# EAGLE design OSSIEPS (EAGLE 6.1)

## Sheet 1 of 3
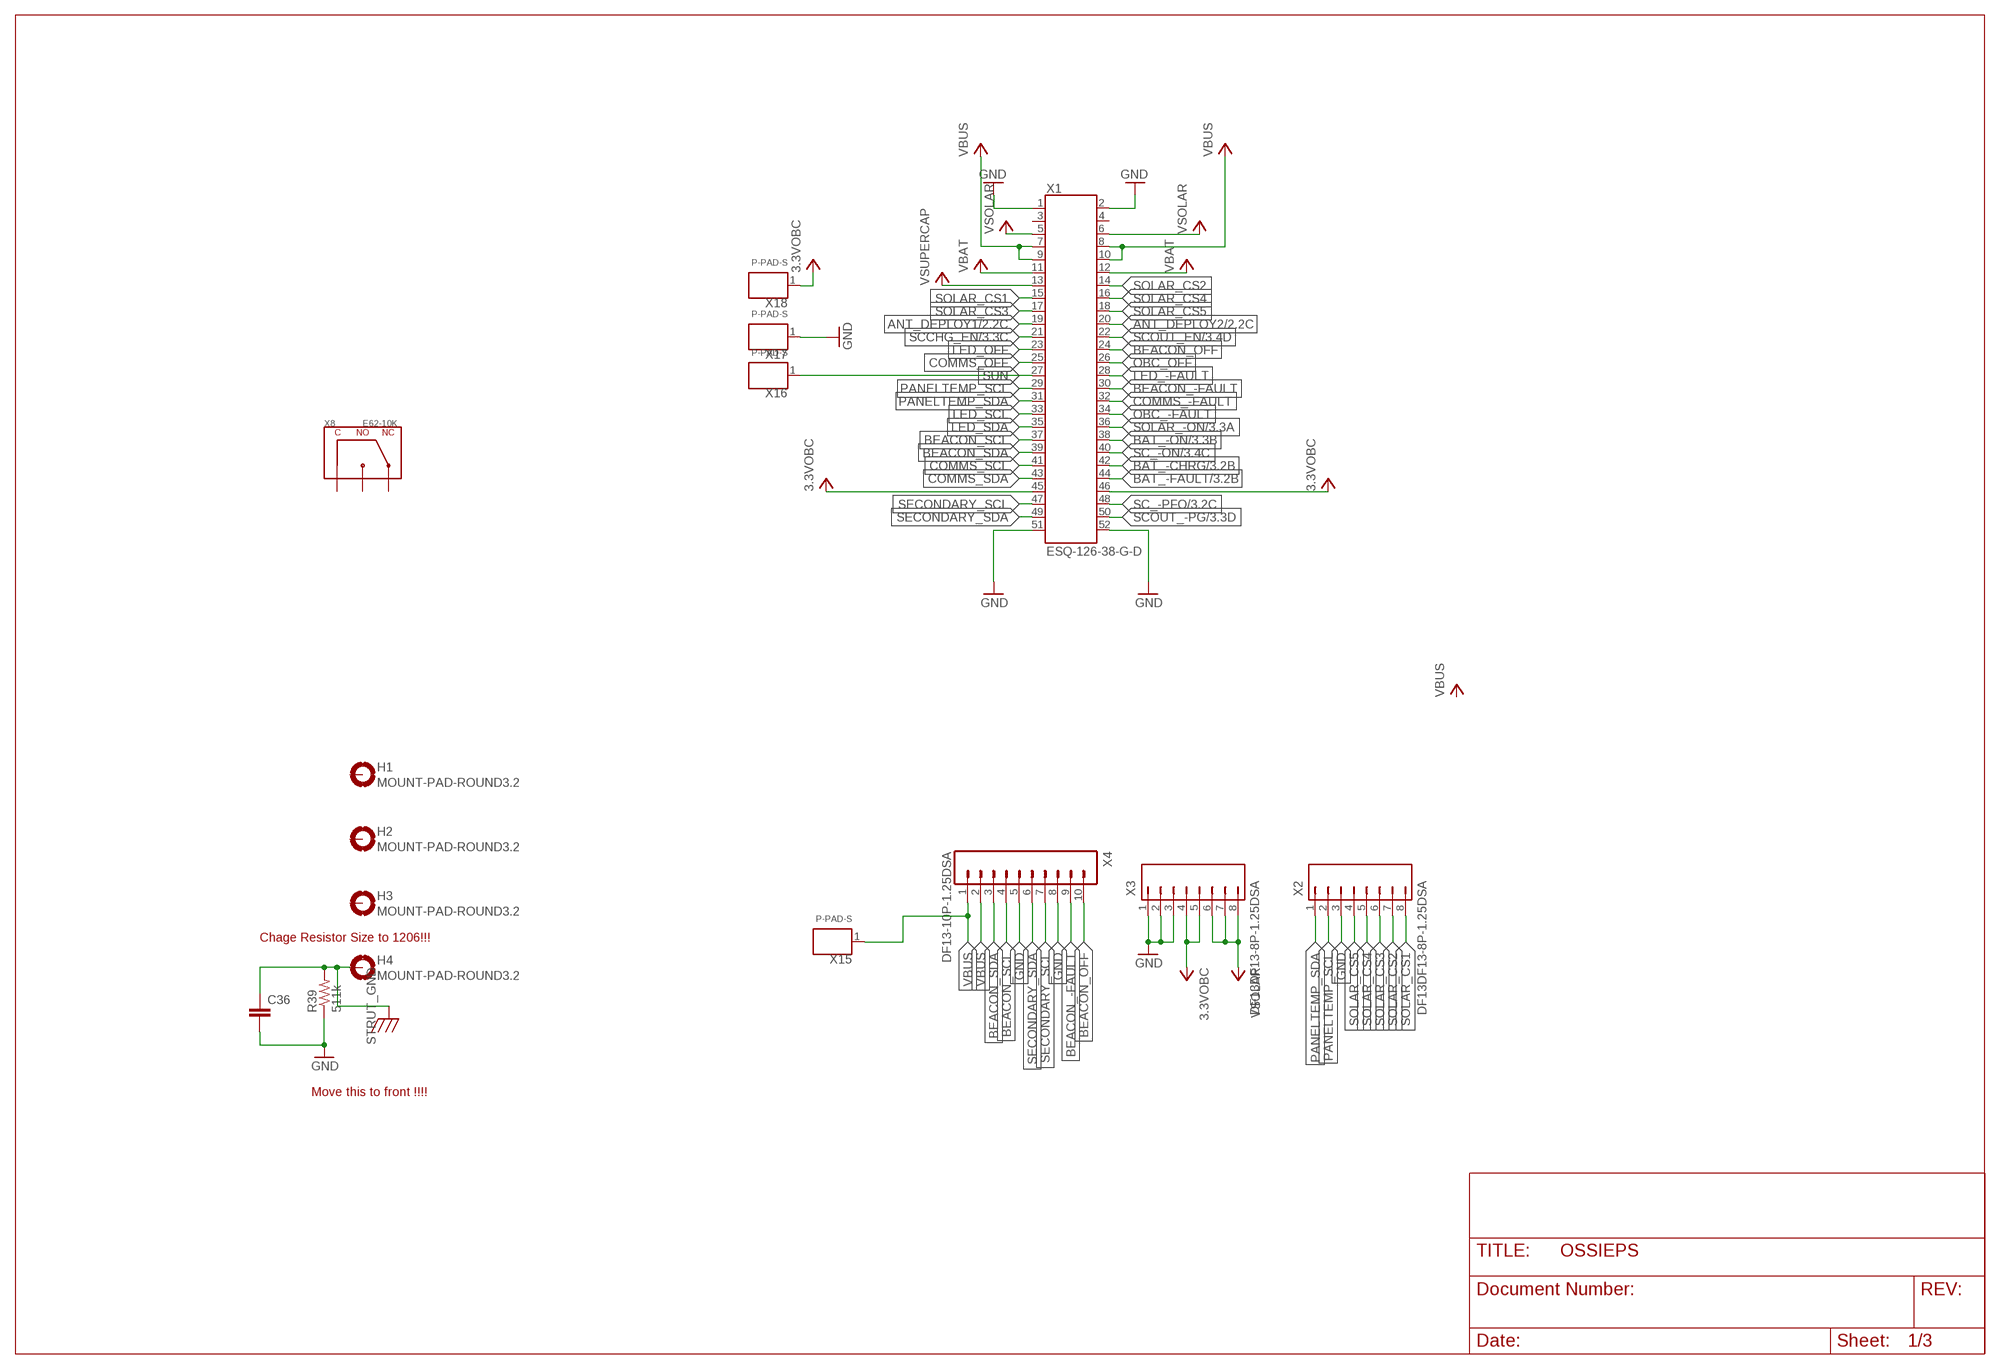
[diagram p0: schematic, sheet 1]

### Parts
C36  C0805(2012)  [C0805(2012)]
H1  MOUNT-PAD-ROUND3.2  [3.2-PAD-ROUND]
H2  MOUNT-PAD-ROUND3.2  [3.2-PAD-ROUND]
H3  MOUNT-PAD-ROUND3.2  [3.2-PAD-ROUND]
H4  MOUNT-PAD-ROUND3.2  [3.2-PAD-ROUND]
R39  511k  R0805(2012)  [R0805(2012)]
X1  ESQ-126-38-G-D  [ESQ-126-XX-X-D]
X2  DF13DF13-8P-1.25DSA  [DF13-8P-1.25DSA]
X3  DF13DF13-8P-1.25DSA  [DF13-8P-1.25DSA]
X4  DF13-10P-1.25DSA  [DF13-10P-1.25DSA]
X8  E62-10K  [E62-10K]
X15  P-PAD-S  [P-PAD-S]
X16  P-PAD-S  [P-PAD-S]
X17  P-PAD-S  [P-PAD-S]
X18  P-PAD-S  [P-PAD-S]

### Nets
3.3VOBC: X1.45 X1.46 X3.4 X3.5 X18.1 ; also sheet 3
ANT_DEPLOY1: X1.19 ; also sheet 2
ANT_DEPLOY2: X1.20 ; also sheet 2
BAT_-CHRG: X1.42 ; also sheet 3
BAT_-FAULT: X1.44 ; also sheet 3
BAT_-ON: X1.38 ; also sheet 3
BEACON_-FAULT: X1.30 X4.9
BEACON_OFF: X1.24 X4.10
BEACON_SCL: X1.37 X4.4
BEACON_SDA: X1.39 X4.3
COMMS_-FAULT: X1.32
COMMS_OFF: X1.25
COMMS_SCL: X1.41
COMMS_SDA: X1.43
GND: C36.2 R39.1 X1.1 X1.2 X1.51 X1.52 X2.3 X3.1 X3.2 X3.3 X4.5 X4.8 X17.1 ; also sheet 2,3
LED_-FAULT: X1.28
LED_OFF: X1.23
LED_SCL: X1.33
LED_SDA: X1.35
OBC_-FAULT: X1.34
OBC_OFF: X1.26
PANELTEMP_SCL: X1.29 X2.2
PANELTEMP_SDA: X1.31 X2.1
SC_-ON: X1.40 ; also sheet 3
SC_-PFO: X1.48 ; also sheet 3
SCCHG_EN: X1.21 ; also sheet 3
SCOUT_-PG: X1.50 ; also sheet 3
SCOUT_EN: X1.22 ; also sheet 3
SECONDARY_SCL: X1.47 X4.7
SECONDARY_SDA: X1.49 X4.6
SOLAR_-ON: X1.36 ; also sheet 3
SOLAR_CS1: X1.15 X2.8
SOLAR_CS2: X1.14 X2.7
SOLAR_CS3: X1.17 X2.6
SOLAR_CS4: X1.16 X2.5
SOLAR_CS5: X1.18 X2.4
STRUT_GND: C36.1 H4.B3,2(MOUNT) R39.2
SUN: X1.27 X16.1
VBAT: X1.11 X1.12 ; also sheet 2,3
VBUS: X1.7 X1.8 X1.9 X1.10 X4.1 X4.2 X15.1 ; also sheet 3
VSOLAR: X1.5 X1.6 X3.6 X3.7 X3.8 ; also sheet 3
VSUPERCAP: X1.13 ; also sheet 3
Unconnected: H1.B3,2(MOUNT) H2.B3,2(MOUNT) H3.B3,2(MOUNT) X1.3 X1.4 X8.C X8.NC X8.NO

### Notes on the sheet
- Chage Resistor Size to 1206!!!
- Move this to front !!!!

## Sheet 2 of 3
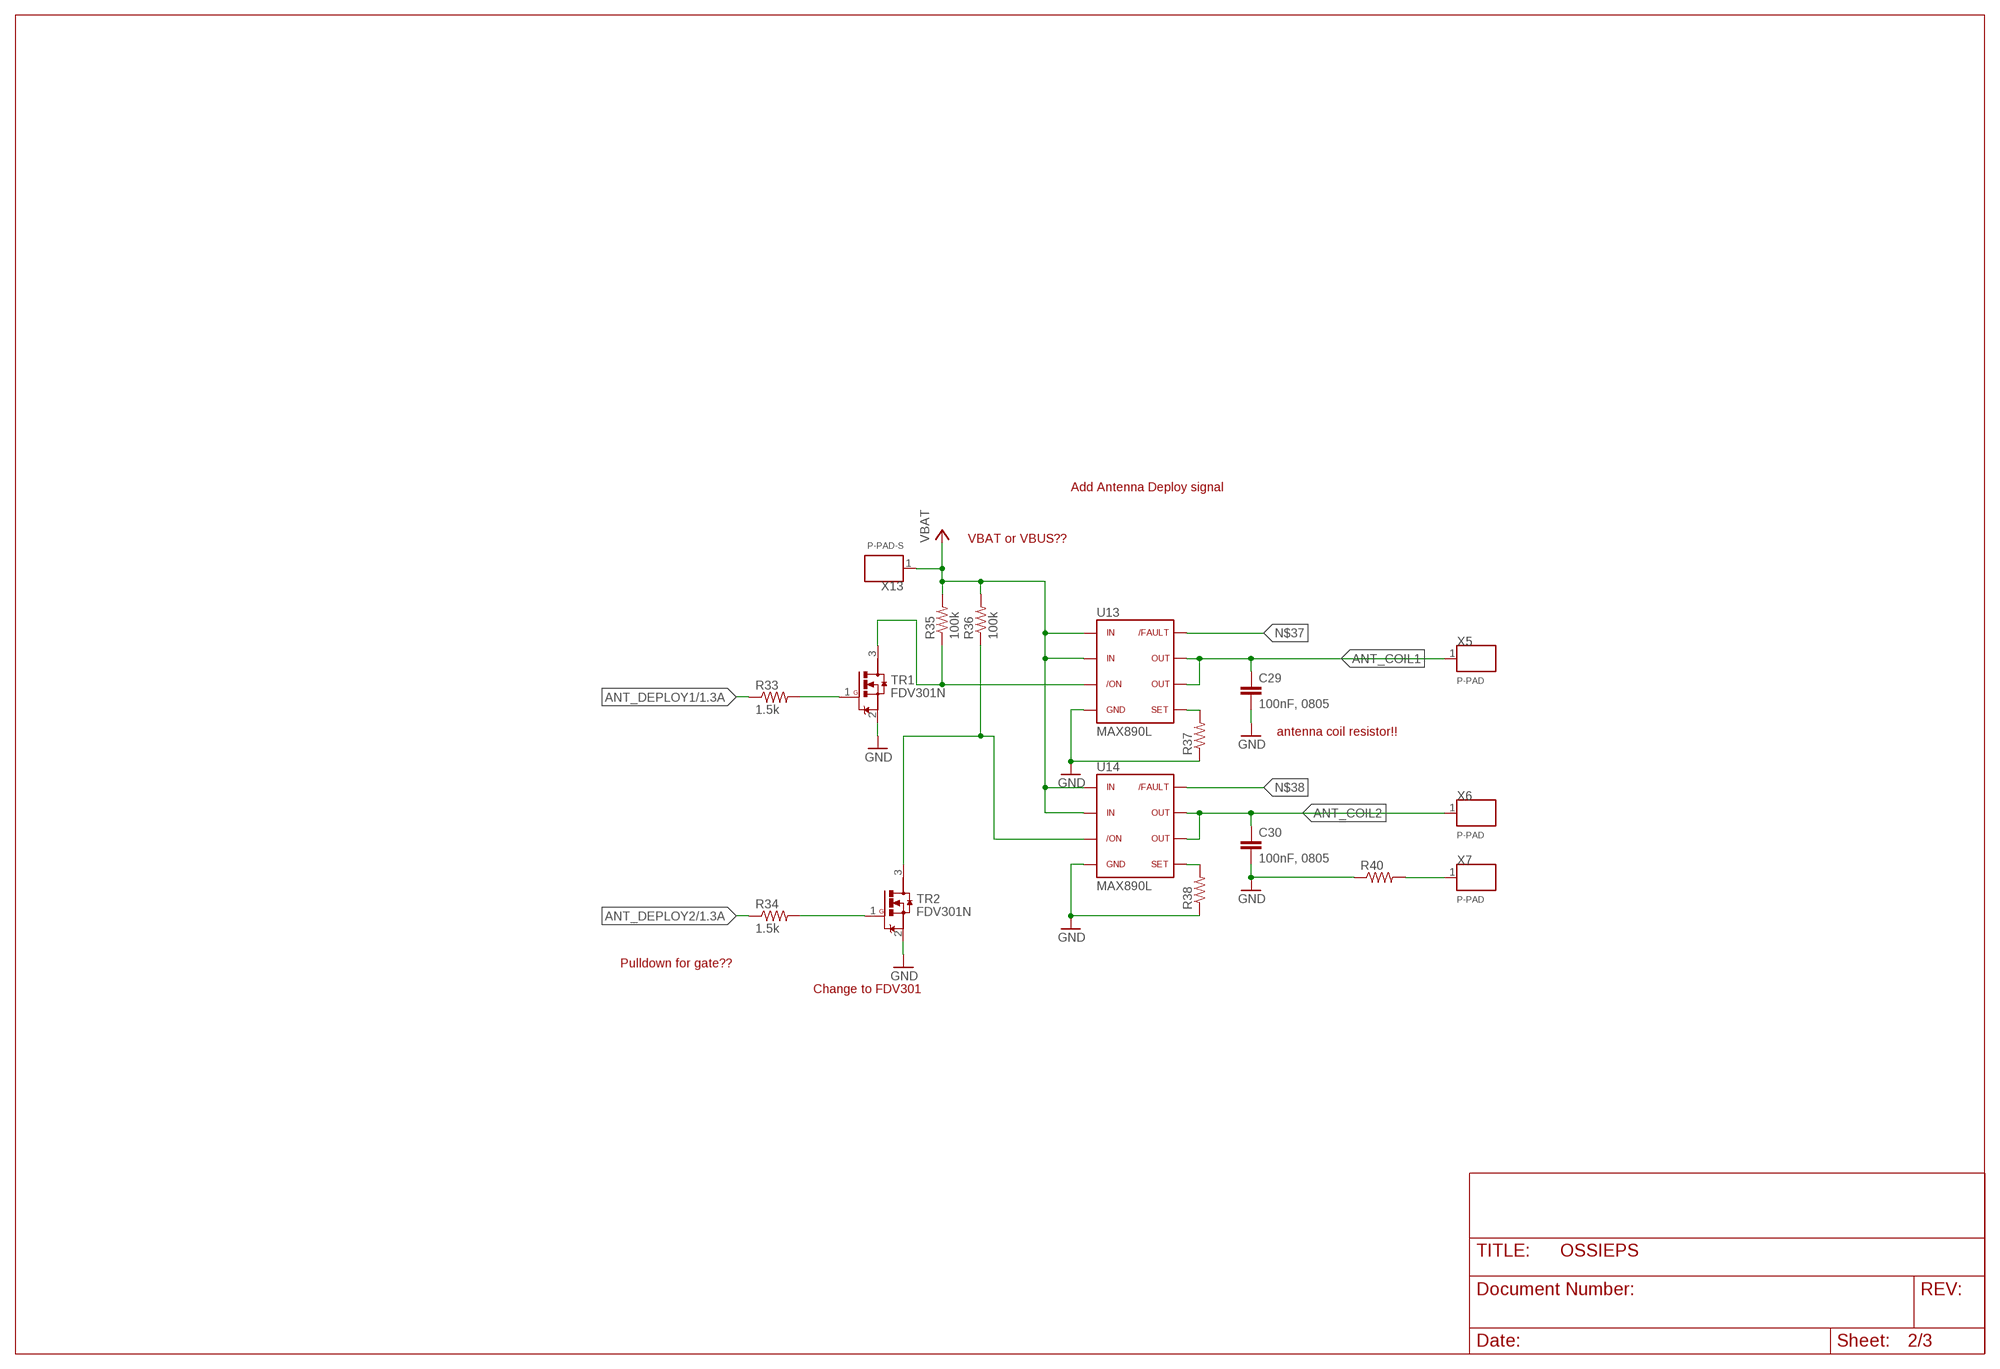
[diagram p1: schematic, sheet 2]

### Parts
C29  100nF, 0805  C0805(2012)  [C0805(2012)]
C30  100nF, 0805  C0805(2012)  [C0805(2012)]
R33  1.5k  R0603(1608)  [R0603(1608)]
R34  1.5k  R0603(1608)  [R0603(1608)]
R35  100k  R0603(1608)  [R0603(1608)]
R36  100k  R0603(1608)  [R0603(1608)]
R37  R0603(1608)  [R0603(1608)]
R38  R0603(1608)  [R0603(1608)]
R40  RPWR263S  [PWR263S-20]
TR1  FDV301N  [SOT23]
TR2  FDV301N  [SOT23]
U13  MAX890L  [SO8]
U14  MAX890L  [SO8]
X5  P-PAD  [P-PAD]
X6  P-PAD  [P-PAD]
X7  P-PAD  [P-PAD]
X13  P-PAD-S  [P-PAD-S]

### Nets
ANT_COIL1: C29.1 U13.6 U13.7 X5.1
ANT_COIL2: C30.1 U14.6 U14.7 X6.1
ANT_DEPLOY1: R33.1 ; also sheet 1
ANT_DEPLOY2: R34.1 ; also sheet 1
GND: C29.2 C30.2 R37.1 R38.1 R40.P$1 TR1.2(S) TR2.2(S) U13.4 U14.4 ; also sheet 1,3
N$33: R34.2 TR2.1(G)
N$37: U13.8
N$38: U14.8
N$49: R33.2 TR1.1(G)
N$50: R35.1 TR1.3(D) U13.3
N$51: R36.1 TR2.3(D) U14.3
N$52: R37.2 U13.5
N$53: R38.2 U14.5
N$57: R40.P$2 X7.1
VBAT: R35.2 R36.2 U13.1 U13.2 U14.1 U14.2 X13.1 ; also sheet 1,3

### Notes on the sheet
- Add Antenna Deploy signal
- VBAT or VBUS??
- antenna coil resistor!!
- Pulldown for gate??
- Change to FDV301

## Sheet 3 of 3
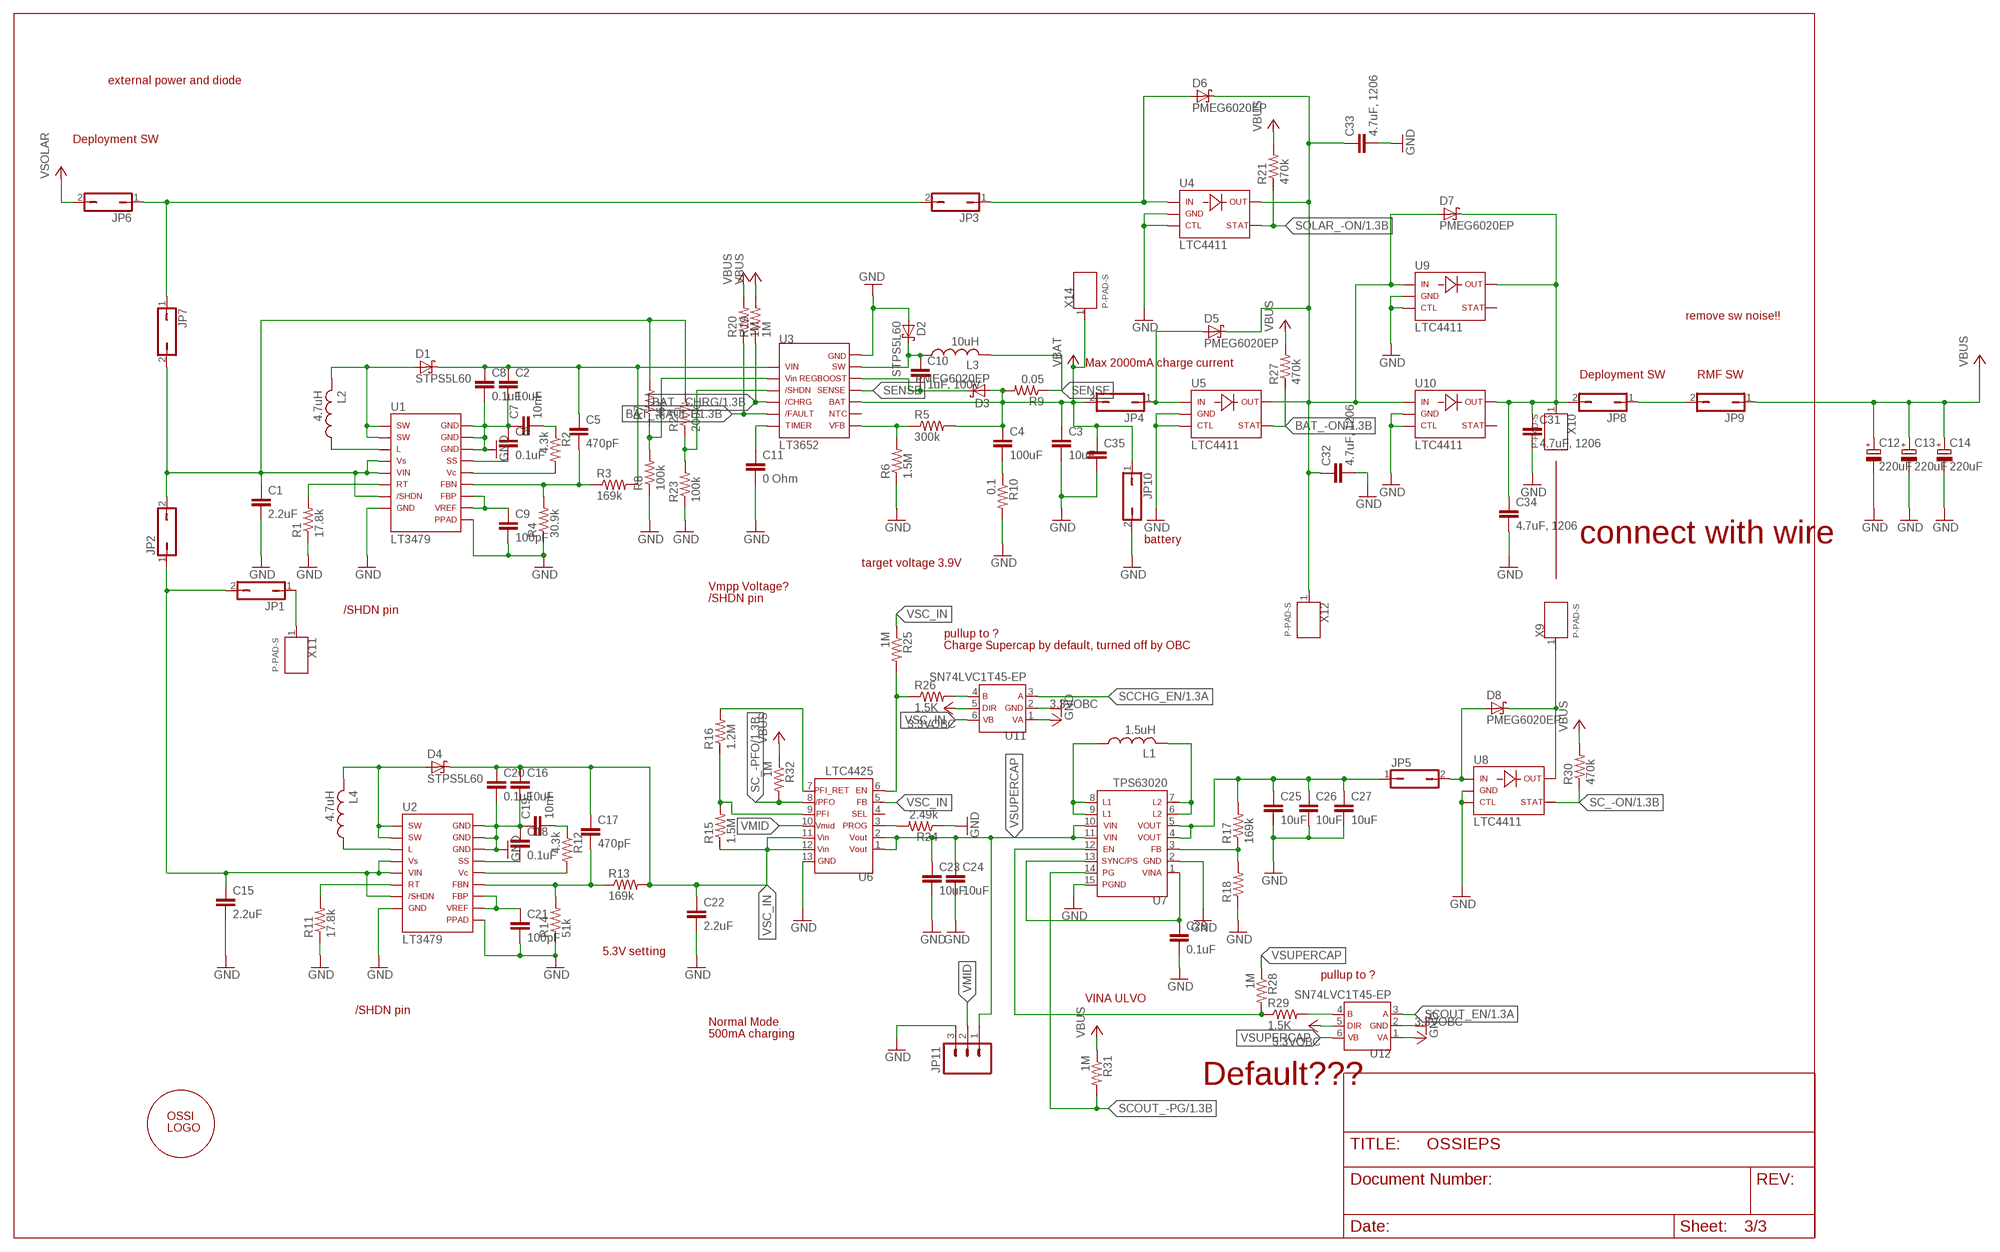
[diagram p2: schematic, sheet 3]

### Parts
C1  2.2uF  C1206(3216)-GCM31  [C1206-GCM31]
C2  10uF  C1210(3225)-GCM32  [C1210-GCM32]
C3  10uF  C1210(3225)-GCM32  [C1210-GCM32]
C4  100uF  C1210(3225)-TMK325  [C1210-TMK325]
C5  470pF  C0603(1608)  [C0603(1608)]
C6  0.1uF  C0603(1608)  [C0603(1608)]
C7  10nF  C0603(1608)  [C0603(1608)]
C8  0.1uF  C0603(1608)  [C0603(1608)]
C9  100pF  C0603(1608)  [C0603(1608)]
C10  1uF, 100V  C0805(2012)  [C0805(2012)]
C11  0 Ohm  C0603(1608)  [C0603(1608)]
C12  220uF  C-TANTAL-Y  [C2917(7343)-Y]
C13  220uF  C-TANTAL-Y  [C2917(7343)-Y]
C14  220uF  C-TANTAL-Y  [C2917(7343)-Y]
C15  2.2uF  C1206(3216)-GCM31  [C1206-GCM31]
C16  10uF  C1210(3225)-GCM32  [C1210-GCM32]
C17  470pF  C0603(1608)  [C0603(1608)]
C18  0.1uF  C0603(1608)  [C0603(1608)]
C19  10nF  C0603(1608)  [C0603(1608)]
C20  0.1uF  C0603(1608)  [C0603(1608)]
C21  100pF  C0603(1608)  [C0603(1608)]
C22  2.2uF  C1206(3216)-GCM31  [C1206-GCM31]
C23  10uF  C1210(3225)-GCM32  [C1210-GCM32]
C24  10uF  C1210(3225)-GCM32  [C1210-GCM32]
C25  10uF  C1210(3225)-GCM32  [C1210-GCM32]
C26  10uF  C1210(3225)-GCM32  [C1210-GCM32]
C27  10uF  C1210(3225)-GCM32  [C1210-GCM32]
C28  0.1uF  C0603(1608)  [C0603(1608)]
C31  4.7uF, 1206  C1206(3216)-GCM31  [C1206-GCM31]
C32  4.7uF, 1206  C1206(3216)-GCM31  [C1206-GCM31]
C33  4.7uF, 1206  C1206(3216)-GCM31  [C1206-GCM31]
C34  4.7uF, 1206  C1206(3216)-GCM31  [C1206-GCM31]
C35  C0603(1608)  [C0603(1608)]
D1  STPS5L60  [STPS5L60]
D2  STPS5L60  [STPS5L60]
D3  PMEG6020EP  [PMEG6020EP]
D4  STPS5L60  [STPS5L60]
D5  PMEG6020EP  [PMEG6020EP]
D6  PMEG6020EP  [PMEG6020EP]
D7  PMEG6020EP  [PMEG6020EP]
D8  PMEG6020EP  [PMEG6020EP]
JP1  JP1Q  [JP1]
JP2  JP1Q  [JP1]
JP3  JP1Q  [JP1]
JP4  JP1Q  [JP1]
JP5  JP1Q  [JP1]
JP6  JP1Q  [JP1]
JP7  JP1Q  [JP1]
JP8  JP1Q  [JP1]
JP9  JP1Q  [JP1]
JP10  JP1Q  [JP1]
JP11  M03POLAR  [MOLEX-1X3]
L1  1.5uH  LXFL4020  [L(4040)]
L2  4.7uH  LRLF7030  [RLF7030]
L3  10uH  LRLF12545  [RLF12545]
L4  4.7uH  LRLF7030  [RLF7030]
R1  17.8k  R0603(1608)  [R0603(1608)]
R2  4.3k  R0603(1608)  [R0603(1608)]
R3  169k  R0603(1608)  [R0603(1608)]
R4  30.9k  R0603(1608)  [R0603(1608)]
R5  300k  R0603(1608)  [R0603(1608)]
R6  1.5M  R0603(1608)  [R0603(1608)]
R7  36k  R0603(1608)  [R0603(1608)]
R8  100k  R0603(1608)  [R0603(1608)]
R9  0.05  RWSL1206  [WSL1206]
R10  0.1  RWSL1206  [WSL1206]
R11  17.8k  R0603(1608)  [R0603(1608)]
R12  4.3k  R0603(1608)  [R0603(1608)]
R13  169k  R0603(1608)  [R0603(1608)]
R14  51k  R0603(1608)  [R0603(1608)]
R15  1.5M  R0603(1608)  [R0603(1608)]
R16  1.2M  R0603(1608)  [R0603(1608)]
R17  169k  R0603(1608)  [R0603(1608)]
R18  R0603(1608)  [R0603(1608)]
R19  1M  R0603(1608)  [R0603(1608)]
R20  1M  R0603(1608)  [R0603(1608)]
R21  470k  R0603(1608)  [R0603(1608)]
R22  200k  R0603(1608)  [R0603(1608)]
R23  100k  R0603(1608)  [R0603(1608)]
R24  2.49k  R0603(1608)  [R0603(1608)]
R25  1M  R0603(1608)  [R0603(1608)]
R26  1.5K  R0603(1608)  [R0603(1608)]
R27  470k  R0603(1608)  [R0603(1608)]
R28  1M  R0603(1608)  [R0603(1608)]
R29  1.5K  R0603(1608)  [R0603(1608)]
R30  470k  R0603(1608)  [R0603(1608)]
R31  1M  R0603(1608)  [R0603(1608)]
R32  1M  R0603(1608)  [R0603(1608)]
U1  LT3479  [TSSOP16-FE]
U2  LT3479  [TSSOP16-FE]
U3  LT3652  [MSE]
U4  LTC4411  [TSOT23-5]
U5  LTC4411  [TSOT23-5]
U6  LTC4425  [MSE]
U7  TPS63020  [VSON-14]
U8  LTC4411  [TSOT23-5]
U9  LTC4411  [TSOT23-5]
U10  LTC4411  [TSOT23-5]
U11  SN74LVC1T45-EP  [SOT-6DCK]
U12  SN74LVC1T45-EP  [SOT-6DCK]
U$1  OSSILOGORECT  [OSSILOGORECT1005]
X9  P-PAD-S  [P-PAD-S]
X10  P-PAD-S  [P-PAD-S]
X11  P-PAD-S  [P-PAD-S]
X12  P-PAD-S  [P-PAD-S]
X14  P-PAD-S  [P-PAD-S]

### Nets
3.3VOBC: U11.1 U11.5 U12.1 U12.5 ; also sheet 1
BAT_-CHRG: R19.1 U3.4 ; also sheet 1
BAT_-FAULT: R20.1 U3.5 ; also sheet 1
BAT_-ON: R27.1 U5.P$4 ; also sheet 1
GND: C1.P$2 C2.P$2 C3.P$2 C6.1 C7.1 C8.2 C9.2 C11.2 C12.2(-) C13.2(-) C14.2(-) C15.P$2 C16.P$2 C18.1 C19.1 C20.2 C21.2 C22.P$2 C23.P$2 C24.P$2 C25.P$2 C26.P$2 C27.P$2 C28.2 C31.P$2 C32.P$2 C33.P$2 C34.P$2 C35.2 D2.A JP10.2 JP11.3 R1.1 R4.1 R6.1 R8.1 R10.P$2 R11.1 R14.1 R18.1 R23.1 R24.1 U1.8 U1.14 U1.15 U1.16 U1.PPAD U2.8 U2.14 U2.15 U2.16 U2.PPAD U3.13 U4.P$2 U4.P$3 U5.P$2 U5.P$3 U6.13 U7.2(GND) U7.15(PGND) U8.P$2 U8.P$3 U9.P$2 U9.P$3 U10.P$2 U10.P$3 U11.2 U12.2 ; also sheet 1,2
N$1: L2.P$1 U1.3
N$2: R7.1 R8.2 U3.2
N$3: C2.P$1 C5.1 C8.1 D1.C R3.2 U3.1
N$4: C4.P$2 R10.P$1
N$5: C6.2 U1.13
N$6: D1.A L2.P$2 U1.1 U1.2
N$7: C7.2 R2.1
N$8: R2.2 U1.12
N$9: C5.2 R3.1 R4.2 U1.11
N$10: C9.1 U1.9 U1.10
N$11: R1.2 U1.6
N$12: R22.1 R23.2 U3.3
N$13: C10.2 D3.C U3.11
N$14: D8.C U8.P$5 X9.1
N$15: L4.P$1 U2.3
N$16: C10.1 D2.C L3.P$1 U3.12
N$17: R5.1 R6.2 U3.7
N$18: C32.P$1 C33.P$1 D5.C D6.C D7.A U4.P$5 U5.P$5 U9.P$1 U10.P$1 X12.1
N$19: C11.1 U3.6
N$20: R26.2 U11.4
N$21: C18.2 U2.13
N$22: D4.A L4.P$2 U2.1 U2.2
N$23: C19.2 R12.1
N$24: R12.2 U2.12
N$25: C17.2 R13.1 R14.2 U2.11
N$26: C21.1 U2.9 U2.10
N$27: R11.2 U2.6
N$28: C15.P$1 JP1.2 JP2.1 U2.4 U2.5 U2.7
N$29: R15.2 R16.1 U6.9
N$30: L1.1 U7.8(L1) U7.9(L1_2)
N$31: R16.2 U6.7
N$32: L1.2 U7.6(L2) U7.7(L2_2)
N$34: C25.P$1 C26.P$1 C27.P$1 JP5.1 R17.2 U7.4(VOUT) U7.5(VOUT2)
N$35: R17.1 R18.2 U7.3(FB)
N$36: C28.1 U7.1(VINA) U7.13(SYNC/PS)
N$39: D6.A JP3.1 U4.P$1
N$40: R24.2 U6.3
N$41: R28.2 R29.1 U7.12(EN)
N$42: D5.A JP4.1 U5.P$1
N$43: D8.A JP5.2 U8.P$1
N$44: C1.P$1 JP2.2 JP7.2 R7.2 R22.2 U1.4 U1.5 U1.7
N$45: R25.2 R26.1 U6.6
N$46: JP3.2 JP6.1 JP7.1
N$47: C31.P$1 C34.P$1 D7.C JP8.2 U9.P$5 U10.P$5 X10.1
N$48: R29.2 U12.4
N$54: JP8.1 JP9.2
N$55: JP1.1 X11.1
SC_-ON: R30.1 U8.P$4 ; also sheet 1
SC_-PFO: R32.2 U6.8 ; also sheet 1
SCCHG_EN: U11.3 ; also sheet 1
SCOUT_-PG: R31.2 U7.14(PG) ; also sheet 1
SCOUT_EN: U12.3 ; also sheet 1
SENSE: L3.P$2 R9.P$1 U3.10
SOLAR_-ON: R21.1 U4.P$4 ; also sheet 1
VBAT: C3.P$1 C4.P$1 C35.1 D3.A JP4.2 JP10.1 R5.2 R9.P$2 U3.9 X14.1 ; also sheet 1,2
VBUS: C12.1(+) C13.1(+) C14.1(+) JP9.1 R19.2 R20.2 R21.2 R27.2 R30.2 R31.1 R32.1 ; also sheet 1
VMID: JP11.2 U6.10
VSC_IN: C16.P$1 C17.1 C20.1 C22.P$1 D4.C R13.2 R15.1 R25.1 U6.5 U6.11 U6.12 U11.6
VSOLAR: JP6.2 ; also sheet 1
VSUPERCAP: C23.P$1 C24.P$1 JP11.1 R28.1 U6.1 U6.2 U7.10(VIN) U7.11(VIN2) U12.6 ; also sheet 1
Unconnected: U3.8 U6.4 U9.P$4 U10.P$4

### Notes on the sheet
- external power and diode
- Deployment SW
- remove sw noise!!
- Max 2000mA charge current
- Deployment SW | RMF SW
- battery | connect with wire
- target voltage 3.9V
- Vmpp Voltage?
- /SHDN pin
- /SHDN pin
- pullup to ?
- Charge Supercap by default, turned off by OBC
- 5.3V setting
- pullup to ?
- VINA ULVO
- /SHDN pin
- Normal Mode
- 500mA charging
- Default???

## Library data of the parts
C1-C11 C15-C36 = OSSI:C
C12-C14 = OSSI:C-TANTAL-Y: TAJY227K010RNJ Taltal Capacitor manufacture: AVX 2917(7343)
D1 D2 D4 = OSSI:STPS5L60: STPS5L60 If: 5A / Vrrm: 60V / Vf: 0.47V @ 5A
D3 D5-D8 = OSSI:PMEG6020EP
H1-H4 = OSSI:MOUNT-PAD-ROUND
JP1-JP10 = OSSI:JP1Q: JUMPER
JP11 = SparkFun:M03: Header 3 Standard 3-pin 0.1" header. Use with straight break away headers (SKU : PRT-00116), right angle break away headers (PRT-00553), swiss pins (PRT-00743), machine pins (PRT-00117), and female headers (PRT-00115). Molex polarized connector foot print use with SKU : PRT-08232 with associated crimp pins and housings.
L1-L4 = OSSI:L
R1-R40 = OSSI:R
TR1 TR2 = OSSI:FDV301N: FDV301N Digital N channel - FET / Rdson = 5 Ohm / Vgs = 0.7~1.06V / Ids = 220mA
U1 U2 = OSSI:LT3479: LT3479 inverting switching convertor Input Voltage Range: 2.5V to 24V 3A, 42V Internal Switch Efﬁciency Power Conversion: Up to 89% Soft-Start Frequency Set by External Resistor: 200kHz to 3.5MHz Protection Against Input Short Circuits and Hot Plugging
U3 = OSSI:LT3652: LT3652 Battery Charger Power Tracking 2A Battery Charger for Solar Power e Input Voltage Range: 4.95V to 32V (40V Abs Max) Programmable Charge Rate Up to 2A Programmable Float Voltage Up to 14.4V 1MHz Fixed Frequency
U4 U5 U8-U10 = OSSI:LTC4411: Linear Techonology LTC4411 ideal diode Small Regulated Forward Voltage (28mV) 2.6A Maximum Forward Current 2.6V to 5.5V Operating Range MOSFET based
U6 = OSSI:LTC4425: LTC4425 Linear SuperCap Charger With Current-Limited Ideal Diode and V/I Monitor
U7 = OSSI:TPS63020: TPS63020 HIGH EFFICIENCY SINGLE INDUCTOR BUCK-BOOST CONVERTER WITH 4-A SWITCHES from Texas Instruments
U11 U12 = OSSI:SN74LVC1T45-EP: SN74LVC1T45-EP SINGLE-BIT DUAL-SUPPLY BUS TRANSCEIVER WITH CONFIGURABLE VOLTAGE TRANSLATION AND 3-STATE OUTPUTS
U13 U14 = OSSI:MAX890L: MAX 890L 1.2A, Current-Limited, High-Side P-Channel Switch with Thermal Shutdown BY MAXIM
U$1 = OSSI:OSSILOGO
X1 = OSSI:ESQ-126-: Samtec ESQ-126-XX-G-D Elevated Sockets Seires ESQ-126-37-G-D ESQ-126-38-G-D ESQ-126-39-G-D
X2 X3 = OSSI:DF13: Hirose DF13 series connector
X4 = OSSI:DF13-10P
X5-X7 X9-X18 = OSSI:P-PAD
X8 = OSSI:E62-10K: Cherry E620-10K spdt sw for Remove Before Flight pin

## Board
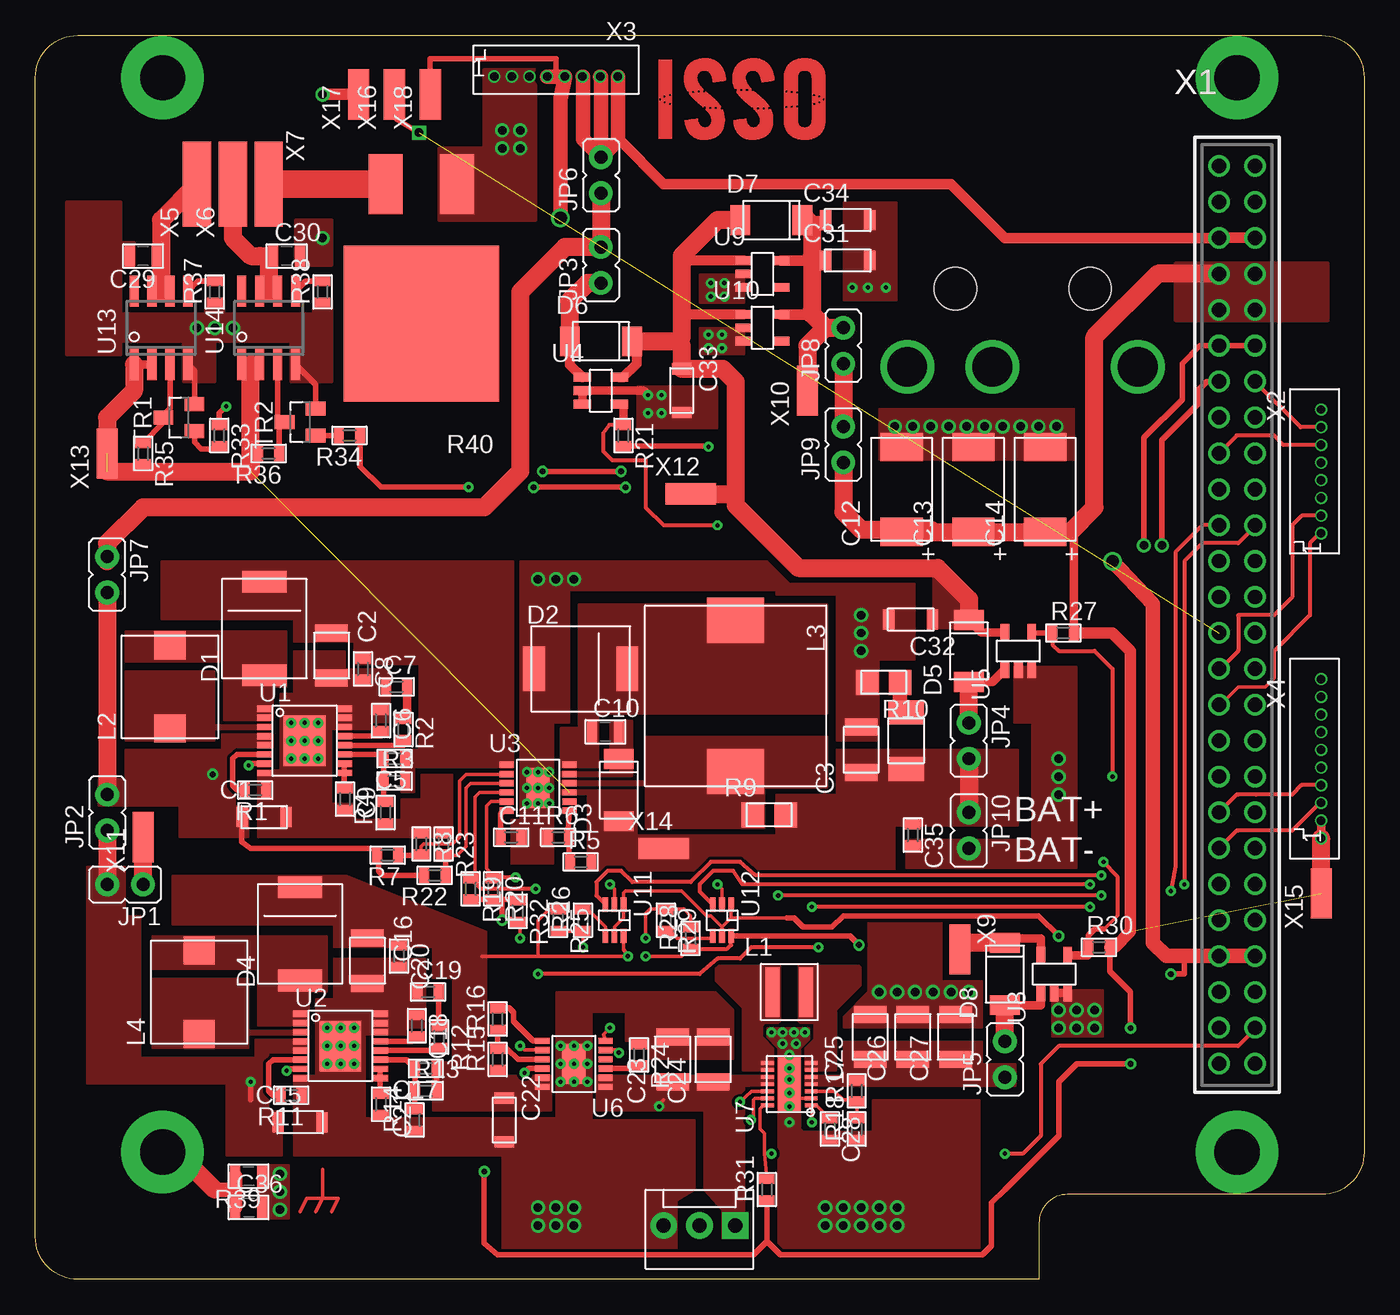
[diagram p3: board, top side]
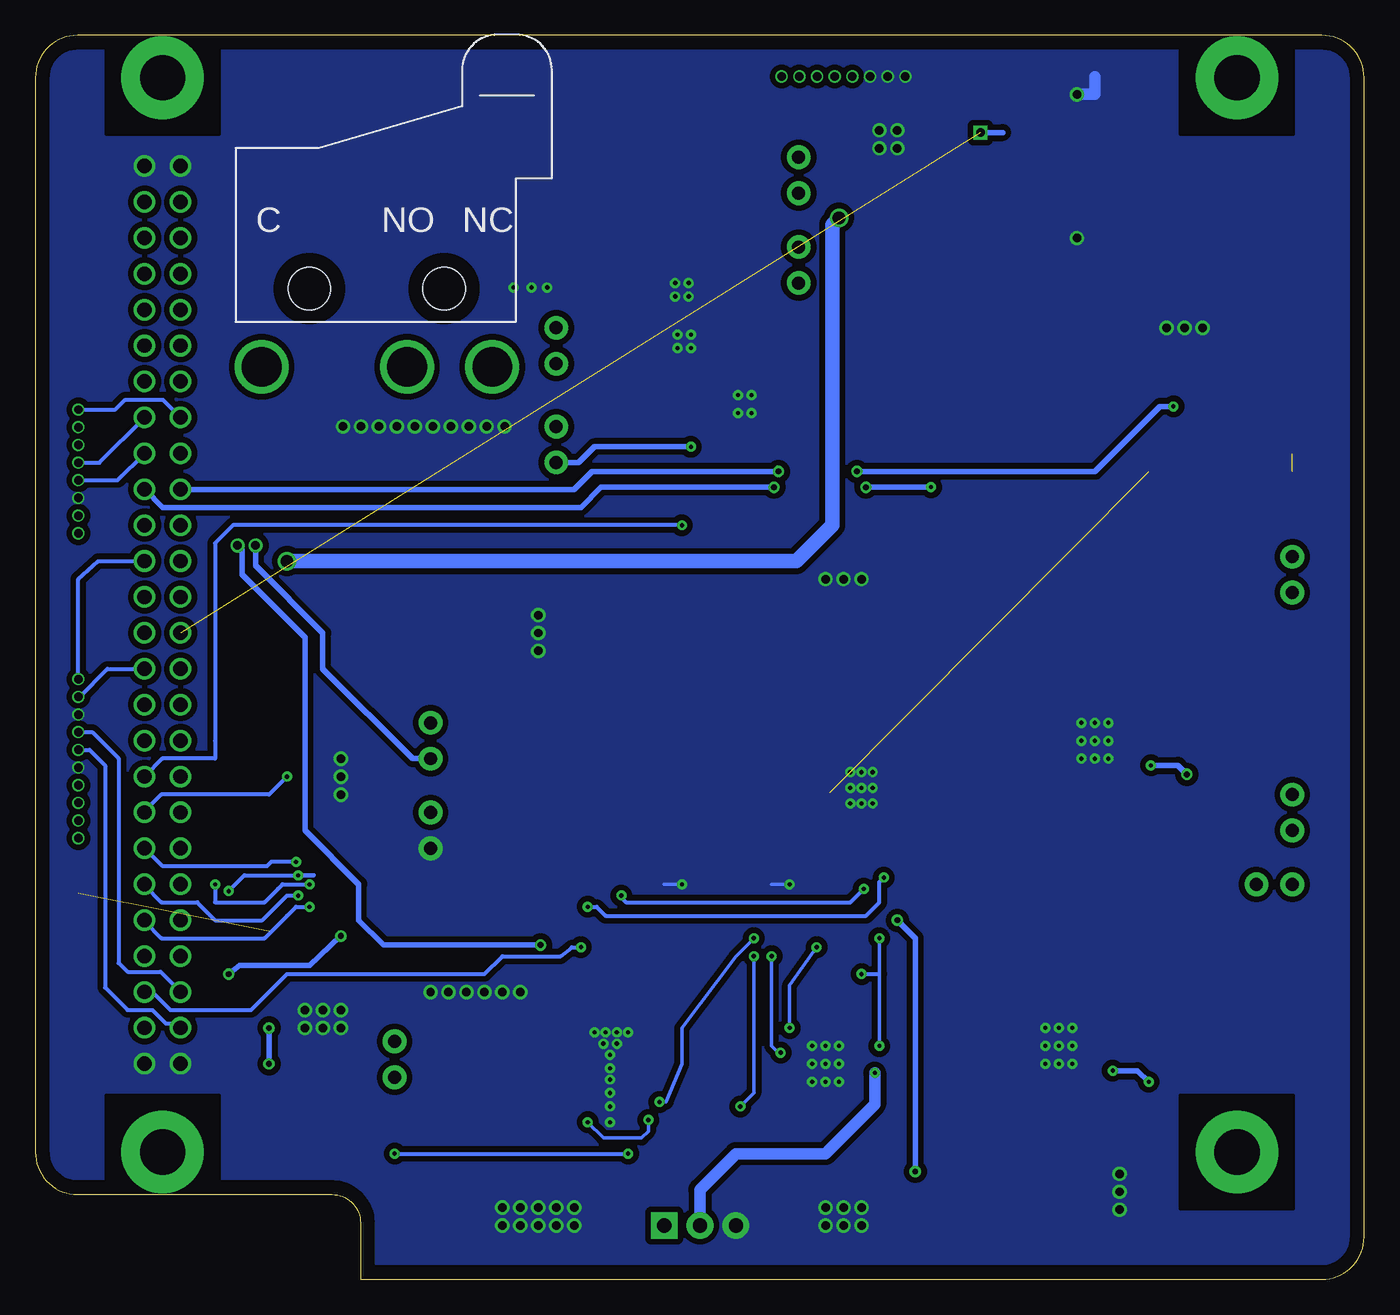
[diagram p4: board, bottom side, seen from below]

Size 94 x 88 mm. Coordinates in mm from the lower left corner, seen from the top.
Outline: 71,0 3,0 arc-90 0,3 0,85 arc-90 3,88 91,88 arc-90 94,85 94,9 arc-90 91,6 73,6 arc90 71,4 71,0
Copper layers (1*16): Top 0.035mm / dielectric 0.8mm / Bottom 0.035mm
Design rules: minimum track width 10mil, minimum drill 10mil, track to track 8mil, track to pad 8mil, pad to pad 8mil, via to via 8mil, smd to smd 8mil, copper to edge 40mil, drill to drill 8mil, minimum pad ring 5mil, minimum via ring 8mil, stop-mask expansion 4mil, vias tented up to drill 0mil, thermal gap 10mil

### Footprints (pad centres in the part's own frame; a part is rotated, then mirrored left to right if it is on the bottom)
C1206-GCM31 = smd 0.8 x 1.4: P$1 -1.55,0; P$2 1.55,0
C1210-GCM32 = smd 1.2 x 2.3: P$1 -1.6,0; P$2 1.6,0
C1210-TMK325 = smd 1.7 x 2.5: P$1 -2,0; P$2 2,0
C0603(1608) = smd 0.7 x 1.1: 1 -0.75,0; 2 0.75,0
C0805(2012) = smd 0.7 x 1.5: 1 -0.95,0; 2 0.95,0
C2917(7343)-Y = smd 2 x 3: 1 -3,0; 2 3,0
STPS5L60 = smd 1.54 x 3.14: A -3.3,0; C 3.3,0
PMEG6020EP = smd 1.4 x 2.1: A -2.2,0; C 2.2,0
3.2-PAD-ROUND = drill 3.2 pad 5.842: B3,2 0,0
JP1 = drill 0.914 pad 1.676: 1 0,-1.27; 2 0,1.27
MOLEX-1X3 = drill 1.016 pad 1.88 square: 1 0,0 | drill 1.016 pad 1.88: 2 2.54,0; 3 5.08,0
L(4040) = smd 1 x 3.5: 1 -1.185,0; 2 1.185,0
RLF7030 = smd 2 x 2.2: P$1 -2.95,0; P$2 2.95,0
RLF12545 = smd 3.2 x 4: P$1 -5.35,0; P$2 5.35,0
R0603(1608) = smd 0.7 x 1.1: 1 -0.75,0; 2 0.75,0
WSL1206 = smd 1.57 x 1.78: P$1 -1.165,0; P$2 1.165,0
R0805(2012) = smd 0.7 x 1.5: 1 -0.95,0; 2 0.95,0
PWR263S-20 = smd 2.4 x 4.23: P$1 -2.54,0; P$2 2.54,0 | smd 11 x 11: TPAD 0,9.865
SOT23 = smd 1 x 1.4: 1 -0.95,-1.1; 2 0.95,-1.1; 3 0,1.1
TSSOP16-FE = smd 0.45 x 1.1: 1 -2.275,-2.8; 2 -1.625,-2.8; 3 -0.975,-2.8; 4 -0.325,-2.8; 5 0.325,-2.8; 6 0.975,-2.8; 7 1.625,-2.8; 8 2.275,-2.8; 9 2.275,2.8; 10 1.625,2.8; 11 0.975,2.8; 12 0.325,2.8; 13 -0.325,2.8; 14 -0.975,2.8; 15 -1.625,2.8; 16 -2.275,2.8 | smd 3.58 x 2.94: PPAD 0,0
MSE = smd 0.45 x 1: 1 -1.625,-2.233; 2 -0.975,-2.233; 3 -0.325,-2.233; 4 0.325,-2.233; 5 0.975,-2.233; 6 1.625,-2.233; 7 1.625,2.233; 8 0.975,2.233; 9 0.325,2.233; 10 -0.325,2.233; 11 -0.975,2.233; 12 -1.625,2.233 | smd 2.845 x 1.65: 13 0,0
TSOT23-5 = smd 0.62 x 1.22: P$1 -0.95,-1.31; P$2 0,-1.31; P$3 0.95,-1.31; P$4 0.95,1.31; P$5 -0.95,1.31
VSON-14 = smd 0.28 x 0.9: 1 -1.5,-1.55; 2 -1,-1.55; 3 -0.5,-1.55; 4 0,-1.55; 5 0.5,-1.55; 6 1,-1.55; 7 1.5,-1.55; 8 1.5,1.55; 9 1,1.55; 10 0.5,1.55; 11 0,1.55; 12 -0.5,1.55; 13 -1,1.55; 14 -1.5,1.55 | smd 4 x 1.58: 15 0,0
SOT-6DCK = smd 0.4 x 1: 1 -0.65,-1.1; 2 0,-1.1; 3 0.65,-1.1; 4 0.65,1.1; 5 0,1.1; 6 -0.65,1.1
SO8 = smd 0.65 x 2.2: 1 -1.905,-2.6; 2 -0.635,-2.6; 3 0.635,-2.6; 4 1.905,-2.6; 5 1.905,2.6; 6 0.635,2.6; 7 -0.635,2.6; 8 -1.905,2.6
ESQ-126-XX-X-D = drill 1.016 pad 1.524: 1 -1.27,31.75; 2 1.27,31.75; 3 -1.27,29.21; 4 1.27,29.21; 5 -1.27,26.67; 6 1.27,26.67; 7 -1.27,24.13; 8 1.27,24.13; 9 -1.27,21.59; 10 1.27,21.59; 11 -1.27,19.05; 12 1.27,19.05; 13 -1.27,16.51; 14 1.27,16.51; 15 -1.27,13.97; 16 1.27,13.97; 17 -1.27,11.43; 18 1.27,11.43; 19 -1.27,8.89; 20 1.27,8.89; 21 -1.27,6.35; 22 1.27,6.35; 23 -1.27,3.81; 24 1.27,3.81; 25 -1.27,1.27; 26 1.27,1.27; 27 -1.27,-1.27; 28 1.27,-1.27; 29 -1.27,-3.81; 30 1.27,-3.81; 31 -1.27,-6.35; 32 1.27,-6.35; 33 -1.27,-8.89; 34 1.27,-8.89; 35 -1.27,-11.43; 36 1.27,-11.43; 37 -1.27,-13.97; 38 1.27,-13.97; 39 -1.27,-16.51; 40 1.27,-16.51; 41 -1.27,-19.05; 42 1.27,-19.05; 43 -1.27,-21.59; 44 1.27,-21.59; 45 -1.27,-24.13; 46 1.27,-24.13; 47 -1.27,-26.67; 48 1.27,-26.67; 49 -1.27,-29.21; 50 1.27,-29.21; 51 -1.27,-31.75; 52 1.27,-31.75
DF13-8P-1.25DSA = drill 0.6: 1 4.375,0; 2 3.125,0; 3 1.875,0; 4 0.625,0; 5 -0.625,0; 6 -1.875,0; 7 -3.125,0; 8 -4.375,0
DF13-10P-1.25DSA = drill 0.6: 1 5.625,0; 2 4.375,0; 3 3.125,0; 4 1.875,0; 5 0.625,0; 6 -0.625,0; 7 -1.875,0; 8 -3.125,0; 9 -4.375,0; 10 -5.625,0
P-PAD = smd 6 x 2: 1 0,0
E62-10K = drill 2.8 pad 3.81: C -17.99,-3.18; NC -1.68,-3.18; NO -7.7,-3.18 | hole 3: -5.08,2.36; -14.61,2.36
P-PAD-S = smd 3.556 x 1.5: 1 0,0

### Placement (x,y rotation side)
C1  16.19,32.7 0 top
C2  20.95,44.13 270 top
C3  58.42,37.47 90 top
C4  61.59,38.1 90 top
C5  25.4,36.83 180 top
C6  24.45,39.53 270 top
C7  25.56,41.91 0 top
C8  23.18,43.18 270 top
C9  21.91,33.97 270 top
C10  40.32,38.73 0 top
C11  33.66,31.27 0 top
C12  61.28,55.88 90 top
C13  66.36,55.88 90 top
C14  71.44,55.88 90 top
C15  18.73,11.11 0 top
C16  23.5,22.54 270 top
C17  27.62,14.92 180 top
C18  26.99,17.94 270 top
C19  27.78,20.32 0 top
C20  25.72,22.86 270 top
C21  24.45,12.38 270 top
C22  33.18,11.27 270 top
C23  45.09,15.56 90 top
C24  47.94,15.56 90 top
C25  59.05,17.14 90 top
C26  62.07,17.14 90 top
C27  65.09,17.14 90 top
C28  56.2,10.64 270 top
C29  7.62,72.39 180 top
C30  17.78,72.39 0 top
C31  57.47,72.07 0 top
C32  61.91,46.67 180 top
C33  45.72,62.87 270 top
C34  57.47,74.93 0 top
C35  62.07,31.43 270 top
C36  15.08,5.08 0 top
D1  16.19,46.04 90 top
D2  38.58,43.18 0 top
D3  41.27,34.61 90 top
D4  18.73,24.45 90 top
D5  66.04,44.45 90 top
D6  40.01,66.36 0 top
D7  52.07,74.93 0 top
D8  68.58,21.59 90 top
H1  9,85 0 top
H2  85,85 0 top
H3  85,9 0 top
H4  9,9 0 top
JP1  6.35,27.94 90 top
JP2  5.08,33.02 0 top
JP3  40.01,71.75 0 top
JP4  66.04,38.1 180 top
JP5  68.58,15.56 0 top
JP6  40.01,78.11 0 top
JP7  5.08,49.85 180 top
JP8  57.15,66.04 0 top
JP9  57.15,59.05 0 top
JP10  66.04,31.75 180 top
JP11  49.52,3.81 180 top
L1  53.34,20.32 0 top
L2  9.53,41.91 90 top
L3  49.53,41.27 270 top
L4  11.59,20.32 90 top
R1  15.56,34.61 180 top
R2  26.04,38.89 270 top
R3  25.4,35.24 0 top
R4  24.77,33.02 90 top
R5  38.58,29.53 0 top
R6  36.99,31.27 0 top
R7  24.92,30 180 top
R8  27.3,30.8 270 top
R9  51.91,32.86 0 top
R10  60.01,42.23 180 top
R11  18.1,13.02 180 top
R12  28.57,17.14 270 top
R13  27.62,13.34 0 top
R14  26.83,11.27 90 top
R15  32.7,15.56 90 top
R16  32.7,18.41 90 top
R17  58.1,13.34 90 top
R18  58.1,10.64 90 top
R19  30.8,27.62 270 top
R20  32.38,27.62 270 top
R21  41.59,59.69 270 top
R22  28.26,28.57 180 top
R23  28.89,30.8 270 top
R24  42.7,15.88 270 top
R25  36.99,25.4 270 top
R26  38.73,25.4 90 top
R27  72.71,45.72 0 top
R28  46.35,24.13 90 top
R29  44.61,25.4 270 top
R30  75.25,23.5 0 top
R31  51.75,6.35 90 top
R32  34.13,26.04 270 top
R33  13.02,59.69 270 top
R34  22.23,59.69 180 top
R35  7.62,58.42 270 top
R36  16.51,58.42 180 top
R37  12.7,69.85 90 top
R38  20.32,69.85 90 top
R39  15.08,7.3 180 top
R40  27.3,77.47 180 top
TR1  10.16,60.96 90 top
TR2  18.73,60.64 90 top
U1  19.05,38.1 270 top
U2  21.59,16.51 270 top
U3  35.56,34.77 270 top
U4  40.01,62.87 270 top
U5  69.53,44.45 0 top
U6  38.1,15.24 90 top
U7  53.34,13.81 90 top
U8  72.07,21.59 0 top
U9  51.44,71.12 270 top
U10  51.44,67.31 270 top
U11  40.96,25.4 180 top
U12  48.58,25.4 180 top
U13  8.89,67.31 0 top
U14  16.51,67.31 0 top
U$1  55.88,86.36 180 top
X1  85,47 0 top
X2  90.96,57.15 270 top
X3  36.83,85.09 180 top
X4  90.96,36.83 270 top
X5  11.43,77.47 90 top
X6  13.97,77.47 90 top
X7  16.51,77.47 270 top
X8  60,67.73 0 bottom
X9  65.41,23.34 270 top
X10  54.61,62.87 90 top
X11  7.62,31.27 90 top
X12  46.35,55.56 0 top
X13  5.08,58.42 90 top
X14  44.45,30.48 0 top
X15  90.96,27.3 90 top
X16  25.4,83.82 90 top
X17  22.86,83.82 90 top
X18  27.94,83.82 90 top

### Tracks (layer width: path | path; a pad name or v marks a point on that pad's centre or on a via)
3.3VOBC  (via drill 0.4, 0.9)
  Top 0.254: U11.5 40.96,24.92 41.59,25.56 41.59,26.51 41.6,26.51 U11.1 41.61,27.32 41.75,27.46 45.72,27.46 47.47,25.72 47.78,25.72 48.58,24.92 | U12.5 48.58,24.92 | 48.58,24.92 49.21,25.56 | 49.21,25.56 49.21,26.48 U12.1 | 49.21,25.56 53.18,25.56
  Top 0.4: 53.18,25.56 53.66,25.56 54.29,24.92 56.36,24.92 57.15,25.72 70.96,25.72 v72.39,24.29 | v80.33,21.59 81.27,21.59 81.28,22.87
  Top 0.406: X18.1 27.94,86.36 36.83,86.36 36.83,85.09 X3.4
  Top 1.016: X1.46 83.83,22.87 83.82,22.86 83.81,22.87 X1.45 81.28,22.87 80,22.87 79.06,23.81 79.06,47.78 v76.2,50.8 | v37.15,75.09 37.15,83.5 37.47,85.09 X3.5 36.83,85.09 X3.4
  Bottom 0.4: v72.39,24.29 74.61,22.23 74.77,22.23 79.53,22.23 v80.33,21.59
  Bottom 1.016: v76.2,50.8 40.16,50.8 37.62,53.34 37.62,74.61 v37.15,75.09
ANT_COIL1
  Top 0.305: U13.7 8.83,69.91 8.89,69.85 8.95,69.91 U13.6 | C29.1 8.57,72.71 8.89,72.39
  Top 1.27: X5.1 8.89,74.93 8.89,72.39 8.89,69.85
ANT_COIL2
  Top 0.254: C30.1 16.51,72.39
  Top 0.305: U14.7 16.45,69.91 16.51,69.85 17.09,69.85 U14.6
  Top 1.27: X6.1 13.97,73.66 15.24,72.39 15.88,72.39 16.51,72.39 16.51,69.85
ANT_DEPLOY1  (via drill 0.3, 0.4)
  Top 0.4: R33.1 13.02,61.28 v13.49,61.75 | v35.88,57.15 v41.43,57.15
  Bottom 0.4: v13.49,61.75 14.45,61.75 19.05,57.15 v35.88,57.15 | v41.43,57.15 54.61,57.15 55.88,55.88 X1.19
ANT_DEPLOY2  (via drill 0.3, 0.4)
  Top 0.4: R34.1 22.98,57.51 24.45,56.04 v30.64,56.04 | v35.24,56.04 v41.75,56.04
  Bottom 0.4: v30.64,56.04 v35.24,56.04 | v41.75,56.04 53.98,56.04 55.4,54.61 84.99,54.61 X1.20
BAT_-CHRG  (via drill 0.3)
  Top 0.254: U3.4 31.43,34.44 31.11,34.13 31.11,28.73 30.8,28.42 R19.1
  Top 0.3: v75.41,27.15 v52.55,27.15 | v35.4,27.62 31.55,27.62 R19.1
  Bottom 0.3: X1.42 86.27,27.85 85.09,26.67 82.55,26.67 81.28,25.4 77.95,25.4 76.52,26.83 76.2,27.15 v75.41,27.15 | v52.55,27.15 52.55,26.99 52.23,26.67 36.35,26.67 v35.4,27.62
BAT_-FAULT  (via drill 0.3)
  Top 0.254: R20.1 32.38,28.57 31.91,29.05 31.91,33.5 32.23,33.81 33.44,33.81 U3.5
  Top 0.3: v74.61,26.35 v54.93,26.35 | v33.97,28.42 32.43,28.42 R20.1
  Bottom 0.3: X1.44 86.27,25.31 85.09,24.13 77.79,24.13 76.2,25.72 75.56,26.35 v74.61,26.35 | v54.93,26.35 54.29,26.35 53.66,25.72 35.24,25.72 34.29,26.67 34.29,28.1 v33.97,28.42
BAT_-ON  (via drill 0.3)
  Top 0.3: R27.1 71.96,44.88 72.39,44.45 74.93,44.45 76.2,43.18 v76.2,35.56
  Top 0.406: R27.1 70.52,45.72 U5.P$4
  Bottom 0.3: v76.2,35.56 77.47,34.29 85.09,34.29 86.36,33.02 86.35,33.03 X1.38
BEACON_-FAULT
  Bottom 0.3: X4.9 90.88,41.2 88.9,43.18 X1.30
BEACON_OFF
  Bottom 0.3: X4.10 90.96,49.53 89.53,50.8 X1.24
BEACON_SCL
  Top 0.3: X4.4 89.56,34.95 88.9,34.29 86.36,34.29 85.09,34.29 84.99,34.29 X1.37
BEACON_SDA
  Top 0.3: X4.3 90.86,33.7 88.9,31.75 85.09,31.75 84.99,31.75 X1.39
GND  (via drill 0.3, 0.6)
  Top 0.254: U7.2 53.45,12.81 53.34,12.7 53.34,13.97 v53.34,14.13 | U12.2 48.58,27.62 v48.26,27.94 | U11.2 40.96,27.62 v40.64,27.94
  Top 0.406: TR1.2 11.26,64.25 U13.4 | TR2.2 19.83,63.29 U14.4
  Top 0.61: U8.P$3 U8.P$2 | 38.73,62.87 38.73,62.71 38.7,62.67 U4.P$3 38.7,62.83 38.73,62.87 | 38.73,62.87 U4.P$2 | 38.73,62.87 43.02,62.87 v43.34,62.55
  Top 0.813: X17.1 v20.32,83.82
  Bottom 0.254: v40.64,27.94 41.91,27.94 | v48.26,27.94 49.53,27.94
  Bottom 0.813: v20.32,83.82 19.05,83.82 19.05,85.09
  other vias: 12.7,67.31 13.97,67.31 11.43,67.31 20.32,73.66 33.02,81.28 34.29,81.28 34.29,80.01 33.02,80.01 19.05,38.1 19.05,36.83 19.05,39.37 35.56,34.77 35.56,35.88 35.56,33.66 21.59,16.51 21.59,17.78 21.59,15.24 38.1,15.24 38.1,16.51 38.1,13.97 20.64,17.78 20.64,16.51 20.64,15.24 22.54,15.24 22.54,16.51 22.54,17.78 20,39.37 20,38.1 20,36.83 18.1,36.83 18.1,38.1 18.1,39.37 37.15,13.97 37.15,15.24 37.15,16.51 39.05,16.51 39.05,15.24 39.05,13.97 53.34,14.92 53.34,15.88 53.34,13.18 52.07,17.46 52.86,17.46 53.66,17.46 54.45,17.46 52.86,16.67 53.82,16.67 53.34,12.22 53.34,11.11 55.88,5.08 58.42,5.08 60.96,5.08 57.15,5.08 59.69,5.08 55.88,3.81 57.15,3.81 58.42,3.81 59.69,3.81 60.96,3.81 17.3,4.92 17.3,6.19 17.3,7.46 34.77,35.88 36.35,35.88 34.77,34.77 36.35,34.77 34.77,33.66 36.35,33.66 60.8,60.33 62.07,60.33 63.34,60.33 64.61,60.33 65.88,60.33 67.15,60.33 68.42,60.33 69.69,60.33 70.96,60.33 72.23,60.33 57.78,70.17 58.9,70.17 60.17,70.17 47.78,70.48 48.74,70.48 47.78,69.53 48.74,69.53 47.62,66.83 48.58,66.83 48.58,65.88 47.62,65.88 43.34,61.28 44.29,62.55 44.29,61.28 72.39,19.05 73.66,19.05 74.93,19.05 72.39,17.78 73.66,17.78 74.93,17.78 59.69,20.32 60.96,20.32 62.23,20.32 63.5,20.32 64.77,20.32 66.04,20.32 72.39,36.83 72.39,34.29 72.39,35.56 58.42,46.99 58.42,45.72 58.42,44.45 35.56,49.53 36.83,49.53 38.1,49.53 35.56,5.08 36.83,5.08 38.1,5.08 35.56,3.81 36.83,3.81 38.1,3.81
  pour Bottom (isolate 0.406, no thermals): 94,88 94,6 71,6 71,0 0,0 0,88
  pour Top (no thermals): 6.03,76.2 6.03,73.34 6.99,73.34 6.99,71.75 6.03,71.75 6.03,68.26 12.06,68.26 12.06,69.22 13.34,69.22 13.34,68.26 19.68,68.26 19.68,69.22 20.95,69.22 20.95,63.5 18.1,63.5 18.1,66.36 12.7,66.36 12.7,63.5 10.48,63.5 10.48,66.36 6.03,66.36 6.03,65.41 2.22,65.41 2.22,76.2
  pour Top (no thermals): 18.41,71.75 18.41,74.93 20.95,74.93 20.95,71.75
  pour Top (isolate 0.406, no thermals): 35.4,85.57 35.4,74.93 28.57,74.93 28.57,80.01 31.75,80.01 31.75,85.57
  pour Top (no thermals): 25.08,43.18 21.91,43.18 21.91,44.45 18.26,44.45 18.26,41.43 17.3,41.43 17.3,36.04 15.72,36.04 15.72,31.27 29.53,31.27 29.53,35.72 27.3,35.72 27.3,33.97 25.88,33.97 25.88,32.54 22.54,32.54 22.54,33.66 20.95,33.66 20.95,38.89 25.08,38.89
  pour Top (no thermals): 36.67,29.37 33.66,29.37 33.66,32.54 34.29,32.54 34.29,50.8 51.59,50.8 51.59,48.74 37.78,48.74 37.78,39.37 36.67,39.37
  pour Top (no thermals): 56.67,38.1 59.69,38.1 59.69,43.81 62.23,43.81 62.23,49.21 53.34,49.21 51.75,50.8 50.8,50.8 50.8,48.74 52.39,48.74 52.39,48.42 56.67,48.42
  pour Top (no thermals): 19.84,19.84 19.84,14.45 18.26,14.45 18.26,8.73 34.29,8.73 34.29,11.43 23.34,11.43 23.34,17.3 27.62,17.3 27.62,22.7 21.11,22.7 21.11,19.84
  pour Top (no thermals): 36.83,20.32 36.83,11.43 33.02,11.43 33.02,0 45.4,0 45.4,5.56 46.67,6.35 46.67,11.27 39.37,11.27 39.37,18.89 41.75,18.89 41.75,16.83 43.5,16.83 43.5,15.56 49.37,15.56 49.37,19.05 48.1,20.32
  pour Top (no thermals): 51.75,17.78 54.77,17.78 54.77,16.99 54.13,16.35 54.13,10.64 54.29,10.48 59.21,10.48 59.21,12.7 66.83,12.7 66.83,0 52.55,0 52.55,16.35 51.75,17.14
  pour Top (no thermals): 57.15,17.78 66.99,17.78 66.99,21.11 64.14,21.11 64.14,25.24 58.9,25.24 58.9,20.32 57.15,18.57
  pour Top (no thermals): 15.72,8.1 15.72,4.29 17.94,4.29 17.94,8.1
  pour Top (no thermals): 71.91,20.48 75.56,20.48 75.56,17.14 71.91,17.14
  pour Top (no thermals): 59.69,58.42 59.69,61.59 73.5,61.59 73.5,57.94 59.69,57.94
  pour Top (no thermals): 60.96,76.2 57.15,76.2 57.15,69.22 60.96,69.22
  pour Top (no thermals): 49.53,71.12 46.99,71.12 46.99,69.06 50.16,69.06 50.16,71.12
  pour Top (no thermals): 49.53,67.31 46.99,67.31 46.99,65.41 50.16,65.41 50.16,67.31
  pour Top (no thermals): 42.55,63.18 48.26,63.18 48.26,60.17 42.55,60.17
  pour Top (no thermals): 61.59,31.11 70.48,31.11 70.48,39.37 69.22,39.37 69.22,43.34 73.66,43.34 73.66,29.05 61.59,29.05
N$1
  pour Top (no thermals): 6.35,43.02 12.7,43.02 12.7,39.21 16.67,39.21 16.67,38.89 12.7,38.89 12.7,38.1 6.35,38.1
N$2
  Top 0.254: R8.2 27.3,30.64 27.46,30.8 29.53,30.8 30,31.27 30,35.24 30.48,35.72 33.44,35.72 U3.2
  Top 0.406: R7.1 27.26,30 R8.2
N$3
  pour Top (no thermals): 8.89,50.8 8.89,46.67 18.26,46.67 18.26,45.09 22.54,45.09 22.54,43.5 27.15,43.5 27.15,37.47 25.88,37.47 25.88,34.45 26.83,34.45 26.83,36.2 33.81,36.2 33.81,50.8
N$4
  Top 1.016: R10.P$1 61.17,40.52 C4.P$2
N$5
  Top 0.406: U1.13 24.45,38.42 C6.2
N$6
  pour Top (no thermals): 6.35,45.88 6.35,43.66 13.34,43.66 13.34,39.53 16.83,39.53 16.83,41.91 17.78,41.91 17.78,45.88
N$7
  Top 0.61: R2.1 26.31,39.64 C7.2
N$8
  Top 0.406: U1.12 26.04,37.77 R2.2
N$9
  Top 0.406: U1.11 24.65,37.12 C5.2 R3.1 24.65,33.77 R4.2
N$10
  Top 0.406: U1.10 U1.9 21.85,34.72 C9.1
N$11
  Top 0.406: U1.6 14.27,37.12 13.97,36.83 13.97,34.92 14.29,34.61 R1.2
N$12
  Top 0.254: U3.3 30.8,35.09 30.48,34.77 30.48,30.64 29.84,30 28.94,30 R23.2
  Top 0.406: R22.1 29.01,29.93 R23.2
N$13
  pour Top (no thermals): 37.15,35.56 42.23,35.56 42.23,39.53 40.64,39.53 40.64,35.88 37.15,35.88
N$14
  Top 0.61: U8.P$5 71.12,24.13 68.58,24.13 D8.C
  Top 1.27: D8.C 65.43,23.79 X9.1
N$15
  pour Top (no thermals): 19.37,17.3 15.08,17.3 15.08,16.35 8.26,16.35 8.26,21.27 15.08,21.27 15.08,17.62 19.37,17.62
N$16
  pour Top (no thermals): 37.15,36.2 37.15,39.05 38.42,39.05 38.42,47.78 56.04,47.78 56.04,40.01 39.85,40.01 39.85,36.2
N$17
  Top 0.406: U3.7 37.66,31.35 R6.2 37.74,29.61 R5.1
N$18
  Top 0.406: C33.P$1 45.72,64.77
  Top 0.61: U5.P$5 66.93,45.76 D5.C
  Top 0.7: U4.P$5 41.59,63.81 42.55,64.77 42.55,66.02 D6.C | U10.P$1 46.04,68.26 45.72,68.58 | U9.P$1 46.04,72.07 45.72,72.39
  Top 1.27: D6.C 45.4,66.36 | 45.4,66.36 45.72,66.04 45.72,64.77 | D7.A 48.26,74.93 45.72,72.39 45.72,68.58 45.72,66.67 45.4,66.36 | C33.P$1 48.62,64.42 49.53,63.5 49.53,55.88 | 49.53,55.88 49.53,54.77 52.07,52.23 53.34,50.96 53.98,50.32 63.82,50.32 66.04,48.1 66.04,46.67 D5.C | X12.1 49.21,55.56 49.53,55.88
  pour Top (no thermals): 63.5,46.67 63.5,50.64 63.98,50.64 66.52,48.1 66.52,46.51 66.52,46.04 63.5,46.04
N$19
  Top 0.406: C11.1 32.91,32.91 33.02,33.02 33.14,33.14 U3.6
N$20
  Top 0.254: R26.2 39.1,26.15 39.69,25.56 40.32,24.92 40.32,24.32 U11.4
N$21
  Top 0.406: U2.13 26.63,16.84 C18.2
N$22
  pour Top (no thermals): 8.26,24.29 20.64,24.29 20.64,20.32 19.37,20.32 19.37,17.94 15.72,17.94 15.72,21.91 8.26,21.91
N$23
  Top 0.406: C19.2 28.53,17.94 R12.1
N$24
  Top 0.406: U2.12 28.36,16.18 R12.2
N$25
  Top 0.406: U2.11 26.26,15.54 C17.2 R13.1 26.83,13.29 R14.2
N$26
  Top 0.406: U2.10 U2.9 24.39,13.19 C21.1
N$27
  Top 0.406: U2.6 16.8,15.54 16.51,15.24 16.51,13.34 16.83,13.02 R11.2
N$28  (via drill 0.3)
  Top 0.406: U2.7 17.9,14.88 v17.78,14.76 | v15.24,13.97 15.24,12.7
  Top 1.27: JP2.1 JP1.2
  Bottom 0.406: v17.78,14.76 16.03,14.76 v15.24,13.97
  pour Top (no thermals): 19.37,16.99 15.56,16.99 15.56,15.72 7.46,15.72 7.46,25.72 6.35,25.72 6.35,29.21 3.65,29.21 3.65,13.81 13.49,13.81 13.49,8.73 17.46,8.73 17.46,11.91 16.51,11.91 16.51,16.03 19.37,16.03
N$29
  Top 0.406: R16.1 32.91,17.66 33.02,17.78 32.7,17.46 R15.2 33.38,16.31 34.13,15.56 35.99,15.56 U6.9
N$30
  pour Top (no thermals): 52.23,14.76 50.01,14.76 50.01,19.21 48.1,21.11 48.1,22.07 48.26,22.23 52.7,22.23 52.7,18.26 52.55,18.1 51.59,18.1 51.44,17.94 51.44,17.14 52.23,16.35
N$31
  Top 0.406: U6.7 35.2,16.86 33.81,18.26 33.81,18.89 33.5,19.21 32.75,19.21 R16.2
N$32
  pour Top (no thermals): 54.45,14.76 56.67,14.76 56.67,19.05 58.42,20.8 58.42,22.07 58.26,22.23 53.98,22.23 53.98,18.26 54.13,18.1 55.09,18.1 55.09,16.99 54.45,16.35
N$33
  Top 0.406: TR2.1 20.52,59.69 R34.2
N$34
  pour Top (no thermals): 54.45,14.45 54.45,13.65 69.37,13.65 69.37,15.24 66.99,15.24 66.99,16.83 57.15,16.83 57.15,14.45
N$35
  Top 0.254: U7.3 56.54,13.31 57.15,12.7 57.99,12.7 R17.1 R18.2
N$36  (via drill 0.3)
  Top 0.254: C28.1 55.27,12.31 U7.1 54.93,12.27 v54.93,11.11 | U7.13 50.91,12.81 50.8,12.7 50.8,11.43 v50.64,11.27
  Bottom 0.254: v50.64,11.27 50.64,10.48 51.12,10 53.82,10 v54.93,11.11
N$39
  Top 0.7: D6.A 37.8,64.7 U4.P$1
  Top 1.27: JP3.1 39.05,70.48 37.78,69.22 37.78,66.38 D6.A
N$40
  Top 0.406: U6.3 42.02,14.91 R24.2
N$41  (via drill 0.3)
  Top 0.254: R28.2 46.35,25.72 45.88,26.19 44.61,26.19 | R29.1 44.61,26.19 | U7.12 50.66,13.31 v49.85,12.54 | v43.18,24.13 43.18,24.77 43.18,25.88 43.5,26.19 44.61,26.19
  Bottom 0.254: v49.85,12.54 49.37,12.54 48.26,15.24 48.26,17.78 44.45,22.86 v43.18,24.13
N$42
  Top 0.61: D5.A 67.69,42.25 U5.P$1
  Top 1.27: JP4.1 D5.A
N$43
  Top 0.61: D8.A 71.12,19.39 U8.P$1
  Top 1.27: JP5.2 D8.A
N$44  (via drill 0.3, 0.4)
  Top 0.406: U1.7 15.2,36.48 v15.08,36.35 | v12.54,35.72 12.7,35.56 | C1.P$1 14.61,32.66 14.61,30.96 15.24,30.48 24.13,30.48 24.13,30.32 R7.2 24.29,29.89 24.29,28.89 24.61,28.57 R22.2
  Top 1.27: JP7.2 JP2.2
  Bottom 0.406: v15.08,36.35 13.18,36.35 v12.54,35.72
  pour Top (no thermals): 16.83,38.58 16.83,37.62 14.13,37.62 14.13,33.5 15.08,33.5 15.08,31.27 10.16,31.27 10.16,33.5 4.45,33.5 4.45,35.4 6.35,35.4 6.35,37.47 13.18,37.47 13.18,38.58
N$45  (via drill 0.3)
  Top 0.254: U6.6 40.2,17.34 v40.64,17.78 | v38.73,23.5 38.73,24.61 | 38.73,24.61 37.03,24.61 R25.2 | 38.73,24.61 R26.1
  Bottom 0.254: v40.64,17.78 40.64,20.8 v38.73,23.5
N$46
  Top 1.27: JP6.1 JP3.2 37.47,73.03 34.29,69.85 34.29,57.15 31.75,54.61 7.62,54.61 5.08,52.07 JP7.1 | JP7.1 5.08,50.8 JP7.1
N$47
  Top 0.61: C34.P$1 54.61,74.93 54.93,74.61
  Top 0.75: 54.93,74.61 54.61,74.93 | C31.P$1 55.24,72.07 54.93,72.39 54.61,72.07 U9.P$5 | U10.P$5 54.61,68.26 54.93,68.58
  Top 1.27: D7.C 54.61,74.93 54.93,74.61 54.93,72.39 54.93,68.58 54.93,68.26 55.88,67.31 | 55.88,67.31 JP8.2 | 55.88,67.31 54.61,66.04 54.61,63.5 X10.1
N$48
  Top 0.254: R29.2 44.88,24.65 45.24,24.29 45.4,24.13 47.76,24.13 U12.4
N$49
  Top 0.406: TR1.1 11.26,59.23 11.75,58.74 12.7,58.74 13.02,59.05 R33.2
N$50
  Top 0.406: U13.3 9.53,61.59 8.89,60.96 TR1.3 9.06,60.61 R35.1
N$51
  Top 0.406: U14.3 17.14,61.11 TR2.3 | TR2.3 17.63,60.61 | R36.1 17.26,60.38 TR2.3
N$52
  Top 0.406: U13.5 10.79,69.85 U13.5 | U13.5 11.48,70.6 R37.2
N$53
  Top 0.406: U14.5 19.11,70.6 R38.2
N$54
  Top 1.27: JP8.1 JP9.2
N$55
  Top 1.27: JP1.1 X11.1
N$56
  cutout Bottom: 5,88 5,81 13,81 13,88
  cutout Bottom: 81,88 81,81 89,81 89,88
  cutout Bottom: 81,13 81,6 89,6 89,13
  cutout Bottom: 5,13 5,5 13,5 13,13
N$57
  Top 1.93: R40.P$2 X7.1
N$58
  Top 0.254: 20.32,7.78 20.32,5.87
N$59
  Top 0.254: 20.32,5.71 19.21,5.71 18.73,4.76 | 20.32,5.71 21.43,5.71 20.95,4.76 | 20.32,5.71 19.84,4.76
PANELTEMP_SCL
  Top 0.3: X2.2 89.58,54.02 88.9,53.34 88.9,48.26 87.63,46.99 85.09,46.99 85.09,44.45 83.82,43.18 X1.29
PANELTEMP_SDA
  Top 0.254: 87.63,44.45 87.63,42.55 87.31,42.23 87,41.91 85.09,41.91 83.82,40.64 X1.31
  Top 0.3: X2.1 90.88,52.77 90.17,52.07 90.17,46.99 87.63,44.45
SC_-ON  (via drill 0.3)
  Top 0.254: 76.56,25.76 75.61,24.8
  Top 0.3: 76.56,25.76 76.56,28.46 v75.56,29.53
  Top 0.4: R30.1 74.5,24.33 74.93,24.77 74.97,24.8 75.61,24.8
  Top 0.61: U8.P$4 74.46,22.9 R30.1
  Bottom 0.3: v75.56,29.53 77.31,29.53 77.63,29.21 84.99,29.21 X1.40
SC_-PFO  (via drill 0.3)
  Top 0.254: U6.8 34.59,16.21 v34.29,16.51 | v34.29,24.13 34.29,25.13 R32.2
  Top 0.3: v55.4,23.5 50.64,23.5 49.85,22.7 48.26,22.7 46.99,21.59 v35.56,21.59
  Bottom 0.254: v34.29,16.51 34.29,21.59 v34.29,24.13
  Bottom 0.3: X1.48 85.64,20.23 84.45,19.05 78.74,19.05 76.2,21.59 62.23,21.59 60.96,22.86 56.83,22.86 56.04,23.5 v55.4,23.5 | v35.56,21.59 34.29,21.59
SCCHG_EN  (via drill 0.3)
  Top 0.3: X1.21 82.56,53.35 80.64,51.44 80.64,29.21 v80.33,27.46 | v75.41,28.57 50.96,28.57 49.85,29.53 47.78,29.53 46.35,28.1 42.23,28.1 41.43,28.89 40.48,28.89 39.69,28.1 39.69,27.15 40.32,26.51 U11.3
  Bottom 0.3: v80.33,27.46 79.22,28.57 v75.41,28.57 | v75.41,28.57 74.3,28.57 v75.41,28.57
SCOUT_-PG  (via drill 0.3)
  Top 0.254: U7.14 51.52,12.31 51.28,12.06 51.28,10.64 51.59,10.32 51.59,8.89 R31.2
  Top 0.3: X1.50 86.27,17.69 85.09,16.51 72.39,16.51 71.12,15.24 71.12,10.16 69.85,8.89 v68.58,8.89 | v52.07,8.89 51.59,8.89
  Bottom 0.3: v68.58,8.89 v52.07,8.89
SCOUT_EN  (via drill 0.3)
  Top 0.3: X1.22 86.27,53.25 85.09,52.07 82.55,52.07 81.28,50.8 81.28,29.21 v81.28,27.94 | v74.61,27.94 50.01,27.94 49.37,28.89 47.94,28.89 46.99,27.94 46.99,27.44 U12.3
  Bottom 0.3: v81.28,27.94 81.28,26.67 77.79,26.67 76.83,27.62 76.52,27.94 v74.61,27.94
SECONDARY_SCL
  Bottom 0.3: X4.7 89.98,38.7 88.11,36.83 88.11,22.38 87.47,21.75 85.15,21.75 X1.47
SECONDARY_SDA
  Bottom 0.3: X4.6 90.16,37.45 89.06,36.35 89.06,20.64 87.47,19.05 85.72,19.05 84.77,18.1 84.04,18.1 X1.49
SENSE
  pour Top (no thermals): 56.04,38.42 56.04,34.77 51.59,34.77 51.59,31.91 43.18,31.91 43.18,34.92 37.15,34.92 37.15,35.24 43.18,35.24 43.18,38.42
SOLAR_-ON  (via drill 0.3)
  Top 0.3: R21.1 40.6,60.44 40.16,59.85 40.16,58.58 40.8,57.94 43.18,57.94 43.18,54.61 44.45,53.34 v48.26,53.34
  Top 0.61: R21.1 41.59,61.88 U4.P$4
  Bottom 0.3: v48.26,53.34 80.01,53.34 81.28,52.07 81.28,38.1 81.28,36.83 85.01,36.83 X1.36
SOLAR_CS1
  Bottom 0.3: X2.8 88.33,61.52 87.63,62.23 84.99,62.23 X1.15
SOLAR_CS2
  Top 0.3: X2.7 89.5,60.27 X1.14
SOLAR_CS3
  Top 0.3: X2.6 88.3,59.02 87.63,59.69 84.99,59.69 X1.17
SOLAR_CS4
  Bottom 0.3: X2.5 89.47,57.77 X1.16
SOLAR_CS5
  Bottom 0.3: X2.4 88.17,56.52 X1.18
STRUT_GND
  Top 1.016: R39.2 14.13,6.35 | 14.13,6.35 C36.1 | 12.7,6.35 14.13,6.35
  Top 1.27: H4.B3,2 10.05,9 12.7,6.35
SUN  (via drill 0.6)  (1 unrouted)
  Top 0.406: X16.1 25.56,83.82 25.56,82.07 v27.15,81.12
  Bottom 0.406: v27.15,81.12 25.56,81.12
VBAT  (via drill 0.6)  (2 unrouted)
  Top 0.4: v78.42,51.91 78.42,59.53 81.12,62.23 81.12,64.77 82.39,66.04 83.5,66.04 83.66,66.04 X1.11 X1.12
  Top 0.406: R35.2 7.62,57.15 | R36.2 15.24,57.15
  Top 0.61: U13.1 U13.2 | U14.1 15.24,64.71 U14.2
  Top 1.27: JP4.2 JP10.1 | U13.1 6.99,62.87 5.08,60.96 5.08,57.15 7.62,57.15 15.24,57.15 15.24,57.78 15.24,64.71
  Bottom 0.4: JP4.2 67.31,36.83 73.66,43.18 73.66,45.72 78.42,50.48 v78.42,51.91
  pour Top (no thermals): 37.15,34.61 37.15,34.29 39.05,34.29 39.05,28.89 60.8,28.89 60.8,32.07 69.53,32.07 69.53,37.47 56.67,37.47 56.67,34.29 52.39,34.29 52.39,31.43 42.55,31.43 42.55,34.61
VBUS  (via drill 0.3, 0.4)  (1 unrouted)
  Top 0.254: 47.58,58.94 v47.62,58.9
  Top 0.4: R21.2 47.58,58.94 | R30.2 76,21.79 77.47,20.32 v77.47,17.78 | v77.47,15.24 73.66,15.24 72.39,13.97 72.39,10.16 68.58,6.35 67.63,5.4 67.63,2.38 66.99,1.75 52.7,1.75 51.75,2.7 | 51.75,2.7 R31.1 51.75,2.7 | 51.75,2.7 50.8,1.75 32.7,1.75 31.75,2.54 v31.75,7.62 | v33.02,25.4 33.02,26.87
  Top 0.406: R19.2 R20.2 33.02,26.87 34.29,26.87 34.29,26.67 34.29,26.79 R32.1
  Top 0.61: 73.66,45.72 R27.2 73.46,52.62 73.2,52.88 | R30.2 76.36,23.5 | X4.2 X4.1
  Top 0.813: 73.66,45.72 76.2,45.72 77.47,44.45 77.47,24.61 76.36,23.5 R30.2
  Top 1.27: JP9.1 57.15,54.29 58.42,53.02 63.36,53.02 C12.1 C13.1 C14.1 73.2,52.88 74.93,54.61 74.93,66.67 79.38,71.12 79.39,71.13 X1.7 | X15.1 90.96,31.11 X4.1
  Bottom 0.4: v47.62,58.9 54.45,58.9 | v77.47,17.78 v77.47,15.24 | v31.75,7.62 31.75,24.13 v33.02,25.4
  Bottom 0.406: 54.45,58.9 55.56,57.78 JP9.1
  pour Top (no thermals): 80.64,71.91 91.44,71.91 91.44,67.79 80.64,67.79
VMID  (via drill 0.3)
  Top 0.406: U6.10 34.92,14.91 v34.61,14.61
  Bottom 0.406: JP11.2
  Bottom 0.813: v34.61,14.61 34.61,12.38 38.1,8.89 44.45,8.89 46.99,6.35 JP11.2
VSC_IN  (via drill 0.3)
  Top 0.254: U11.6 41.61,23.35 v41.91,22.86 35.56,22.86 | 35.56,22.86 31.59,22.86 | U6.5 41.09,16.21 v41.27,16.03 | R25.1 36.31,26.15 35.56,25.4 35.56,22.86
  Top 0.406: R13.2 C17.1
  Bottom 0.254: v41.27,16.03 41.43,16.03 41.91,16.51 v41.91,22.86
  pour Top (no thermals): 9.68,28.57 22.07,28.57 31.91,24.61 31.91,15.08 33.34,15.08 33.34,14.45 36.51,14.45 36.51,11.91 28.1,11.91 28.1,15.4 29.53,15.4 29.53,21.27 28.1,21.27 28.1,23.5 21.11,23.5 21.11,25.08 9.68,25.08
VSOLAR
  Top 0.75: 41.2,80.58 41.34,80.58 44.45,77.47 64.77,77.47 68.58,73.66 83.82,73.66 83.81,73.67 X1.5 X1.6
  Top 1.016: X3.7 40.01,85.09 JP6.2 | X3.6 38.73,85.09 38.73,81.6 38.73,80.64 JP6.2 | X3.8 41.2,80.58 JP6.2
VSUPERCAP  (via drill 0.3, 0.4, 0.6)
  Top 0.254: R28.1 46.24,23.38 45.72,22.86 v43.18,22.86 | v44.13,12.22 44.13,12.38 44.45,12.7
  Top 0.3: R28.1 48.94,23.38 49.21,23.65 49.21,24.29 49.22,24.29 U12.6
  Top 0.4: U12.6 57.62,24.3 v58.26,23.65 | v79.69,51.91 79.69,59.37 82.23,61.91 82.23,62.87 82.87,63.5 X1.13
  Bottom 0.254: v43.18,22.86 43.18,13.18 v44.13,12.22
  Bottom 0.4: v58.26,23.65 69.37,23.65 71.12,25.4 71.12,27.94 74.93,31.75 74.93,45.4 79.38,49.85 79.38,51.59 v79.69,51.91
  pour Top (no thermals): 39.69,14.45 39.69,11.91 47.31,11.91 47.31,6.35 48.58,4.92 48.58,2.86 50.16,2.86 50.16,13.65 52.23,13.65 52.23,14.45

### Text on the board
tPlace: BAT+ | BAT-